# EAGLE design new_board (EAGLE 7.5.0)
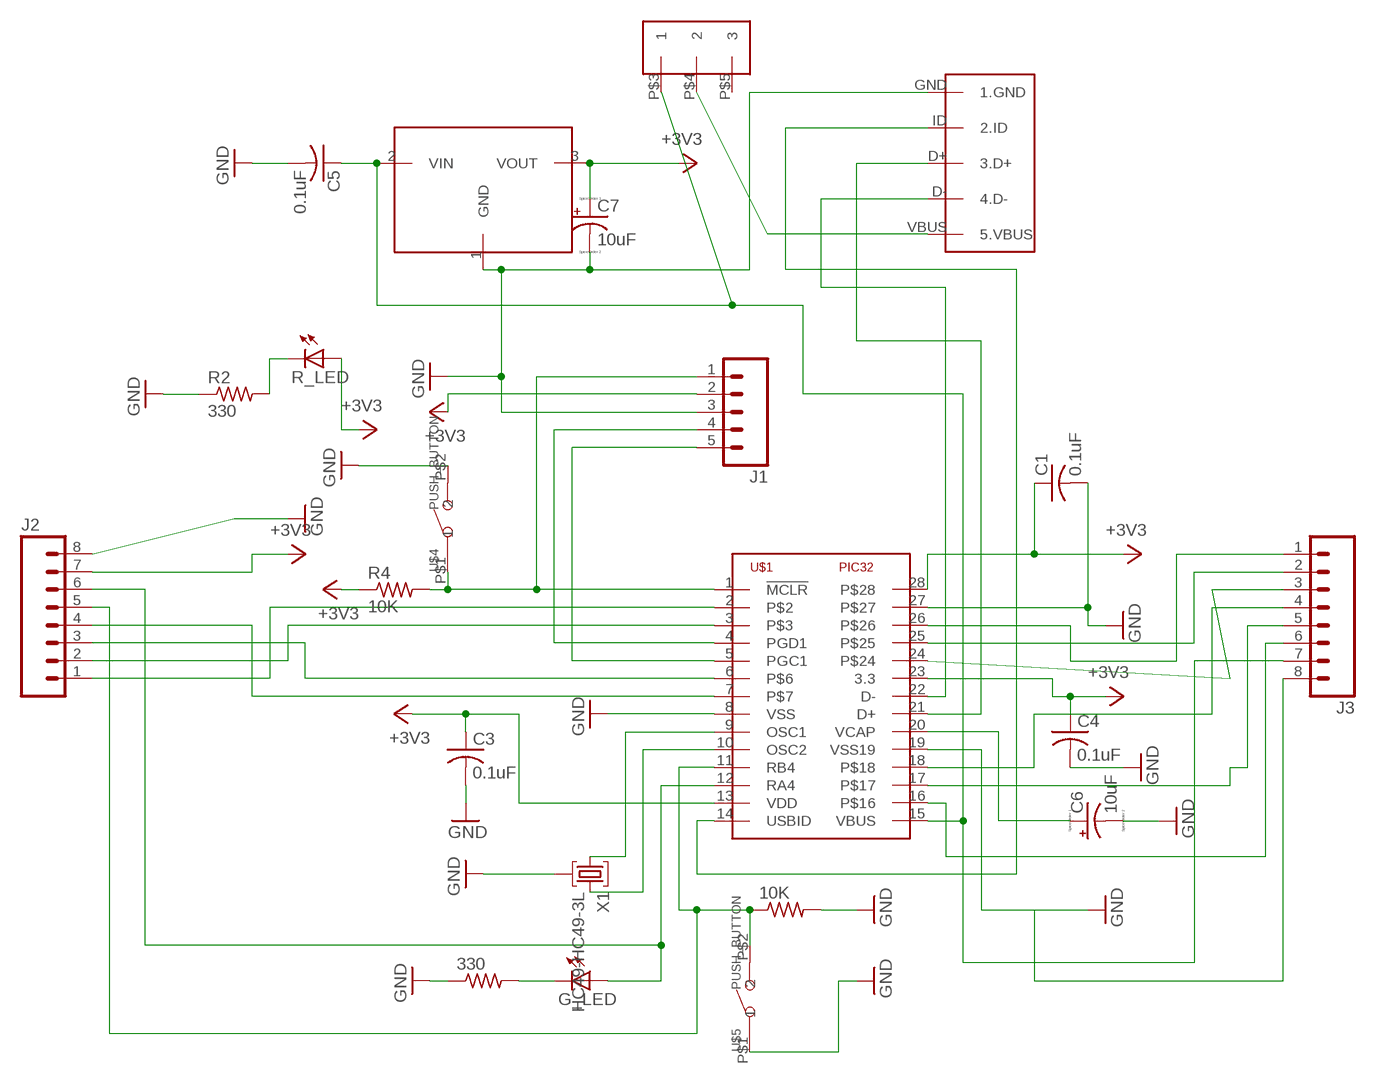
[diagram p0: schematic, sheet 1]

## Parts
10K  R-US_0207/10  [0207/10]
330  R-US_0207/10  [0207/10]
.  MINI_USB  [USB-MB-H]
C1  0.1uF  C-US025-025X050  [C025-025X050]
C3  0.1uF  C-US025-025X050  [C025-025X050]
C4  0.1uF  C-US025-025X050  [C025-025X050]
C5  0.1uF  C-US025-025X050  [C025-025X050]
C6  10uF  CPOL-USTT2D5  [TT2D5]
C7  10uF  CPOL-USTT2D5  [TT2D5]
G_LED  LED3MM  [LED3MM]
J1  M05NO_SILK  [1X05_NO_SILK]
J2  M08  [1X08_ROUND]
J3  M08  [1X08_ROUND]
R2  330  R-US_0207/10  [0207/10]
R4  10K  R-US_0207/10  [0207/10]
R_LED  LED3MM  [LED3MM]
U$1  PIC32  [DIL28-3]
U$3  SLIDE_SWITCH  [SLIDE_SWITCH]
U$4  PUSH_BUTTON  [PUSH_BUTTON]
U$5  PUSH_BUTTON  [PUSH_BUTTON]
U$9  MCP1702  [TO92]
X1  HC49-HC49-3L  [HC49-3L]

## Nets
+3V3: C1.1 C3.1 C4.1 C7.+ J1.2 J2.7 R4.1 R_LED.A U$1.13(VDD) U$1.23(3.3) U$1.28 U$9.3(VOUT)
GND: 10K.2 330.1 ..GND(1.GND) C1.2 C3.2 C4.2 C5.2 C6.- C7.- J1.3 J2.8 J3.8 R2.1 U$1.8(VSS) U$1.19(VSS19) U$1.27 U$4.P$2 U$5.P$1 U$9.1(GND) X1.2
N$1: ..ID(2.ID) U$1.14(USBID)
N$2: J1.4 U$1.4(PGD1)
N$3: J1.5 U$1.5(PGC1)
N$4: U$1.9(OSC1) X1.1
N$5: U$1.10(OSC2) X1.3
N$6: 10K.1 J2.5 U$1.11(RB4) U$5.P$2
N$8: R2.2 R_LED.K(C)
N$9: J1.1 R4.2 U$1.1(!MCLR) U$4.P$1
N$10: C6.+ U$1.20(VCAP)
N$11: 330.2 G_LED.K(C)
N$12: G_LED.A J2.6 U$1.12(RA4)
N$13: ..VBUS(5.VBUS) U$3.P$4
N$14: C5.1 J3.7 U$1.15(VBUS) U$3.P$3 U$9.2(VIN)
N$15: ..D-(4.D-) U$1.22(D-)
N$16: ..D+(3.D+) U$1.21(D+)
N$19: J2.1 U$1.2
N$20: J2.2 U$1.3
N$21: J2.3 U$1.6
N$22: J2.4 U$1.7
N$23: J3.1 U$1.26
N$24: J3.2 U$1.25
N$25: J3.3 U$1.24
N$26: J3.4 U$1.18
N$27: J3.5 U$1.17
N$28: J3.6 U$1.16
Unconnected: U$3.P$5

## Library data of the parts
10K 330 R2 R4 = new_library:R-US_: RESISTOR, American symbol
. = new_library:MINI_USB
C1 C3-C5 = new_library:C-US: CAPACITOR, American symbol
C6 C7 = new_library:CPOL-US: POLARIZED CAPACITOR, American symbol
G_LED R_LED = new_library:LED: LED OSRAM: - CHIPLED LG R971, LG N971, LY N971, LG Q971, LY Q971, LO R971, LY R971 LH N974, LH R974 LS Q976, LO Q976, LY Q976 LO Q996 - Hyper CHIPLED LW Q18S LB Q993, LB Q99A, LB R99A - SideLED LS A670, LO A670, LY A670, LG A670, LP A670 LB A673, LV A673, LT A673, LW A673 LH A674 LY A675 LS A676, LA A676, LO A676, LY A676, LW A676 LS A679, LY A679, LG A679 - Hyper Micro SIDELED® LS Y876, LA Y876, LO Y876, LY Y876 LT Y87S - SmartLED LW L88C, LW L88S LB L89C, LB L89S, LG L890 LS L89K, LO L89K, LY L89K LS L896, LA L896, LO L896, LY L896 - TOPLED LS T670, LO T670, LY T670, LG T670, LP T670 LSG T670, LSP T670, LSY T670, LOP T670, LYG T670 LG T671, LOG T671, LSG T671 LB T673, LV T673, LT T673, LW T673 LH T674 LS T676, LA T676, LO T676, LY T676, LB T676, LH T676, LSB T676, LW T676 LB T67C, LV T67C, LT T67C, LS T67K, LO T67K, LY T67K, LW E67C LS E67B, LA E67B, LO E67B, LY E67B, LB E67C, LV E67C, LT E67C LW T67C LS T679, LY T679, LG T679 LS T770, LO T770, LY T770, LG T770, LP T770 LB T773, LV T773, LT T773, LW T773 LH T774 LS E675, LA E675, LY E675, LS T675 LS T776, LA T776, LO T776, LY T776, LB T776 LHGB T686 LT T68C, LB T68C - Hyper Mini TOPLED® LB M676 - Mini TOPLED Santana® LG M470 LS M47K, LO M47K, LY M47K Source: http://www.osram.convergy.de LUXEON: - LUMILED® LXK2-PW12-R00, LXK2-PW12-S00, LXK2-PW14-U00, LXK2-PW14-V00 LXK2-PM12-R00, LXK2-PM12-S00, LXK2-PM14-U00 LXK2-PE12-Q00, LXK2-PE12-R00, LXK2-PE12-S00, LXK2-PE14-T00, LXK2-PE14-U00 LXK2-PB12-K00, LXK2-PB12-L00, LXK2-PB12-M00, LXK2-PB14-N00, LXK2-PB14-P00, LXK2-PB14-Q00 LXK2-PR12-L00, LXK2-PR12-M00, LXK2-PR14-Q00, LXK2-PR14-R00 LXK2-PD12-Q00, LXK2-PD12-R00, LXK2-PD12-S00 LXK2-PH12-R00, LXK2-PH12-S00 LXK2-PL12-P00, LXK2-PL12-Q00, LXK2-PL12-R00 Source: www.luxeon.com KINGBRIGHT: KA-3528ASYC Source: www.kingbright.com
J1 = new_library:M05: Header 5 Standard 5-pin 0.1" header. Use with straight break away headers (SKU : PRT-00116), right angle break away headers (PRT-00553), swiss pins (PRT-00743), machine pins (PRT-00117), and female headers (PRT-00115). Molex polarized connector foot print use with SKU : PRT-08230 with associated crimp pins and housings.
J2 J3 = new_library:M08: Header 8 Standard 8-pin 0.1" header. Use with straight break away headers (SKU : PRT-00116), right angle break away headers (PRT-00553), swiss pins (PRT-00743), machine pins (PRT-00117), and female headers (PRT-00115).; PROD_ID: CONN-08437
U$1 = new_library:PIC32
U$3 = new_library:SLIDE_SWITCH
U$4 U$5 = new_library:PUSH_BUTTON
U$9 = new_library:MCP1702
X1 = new_library:HC49: Crystals; MFD: IQD Frequency Products

## Board
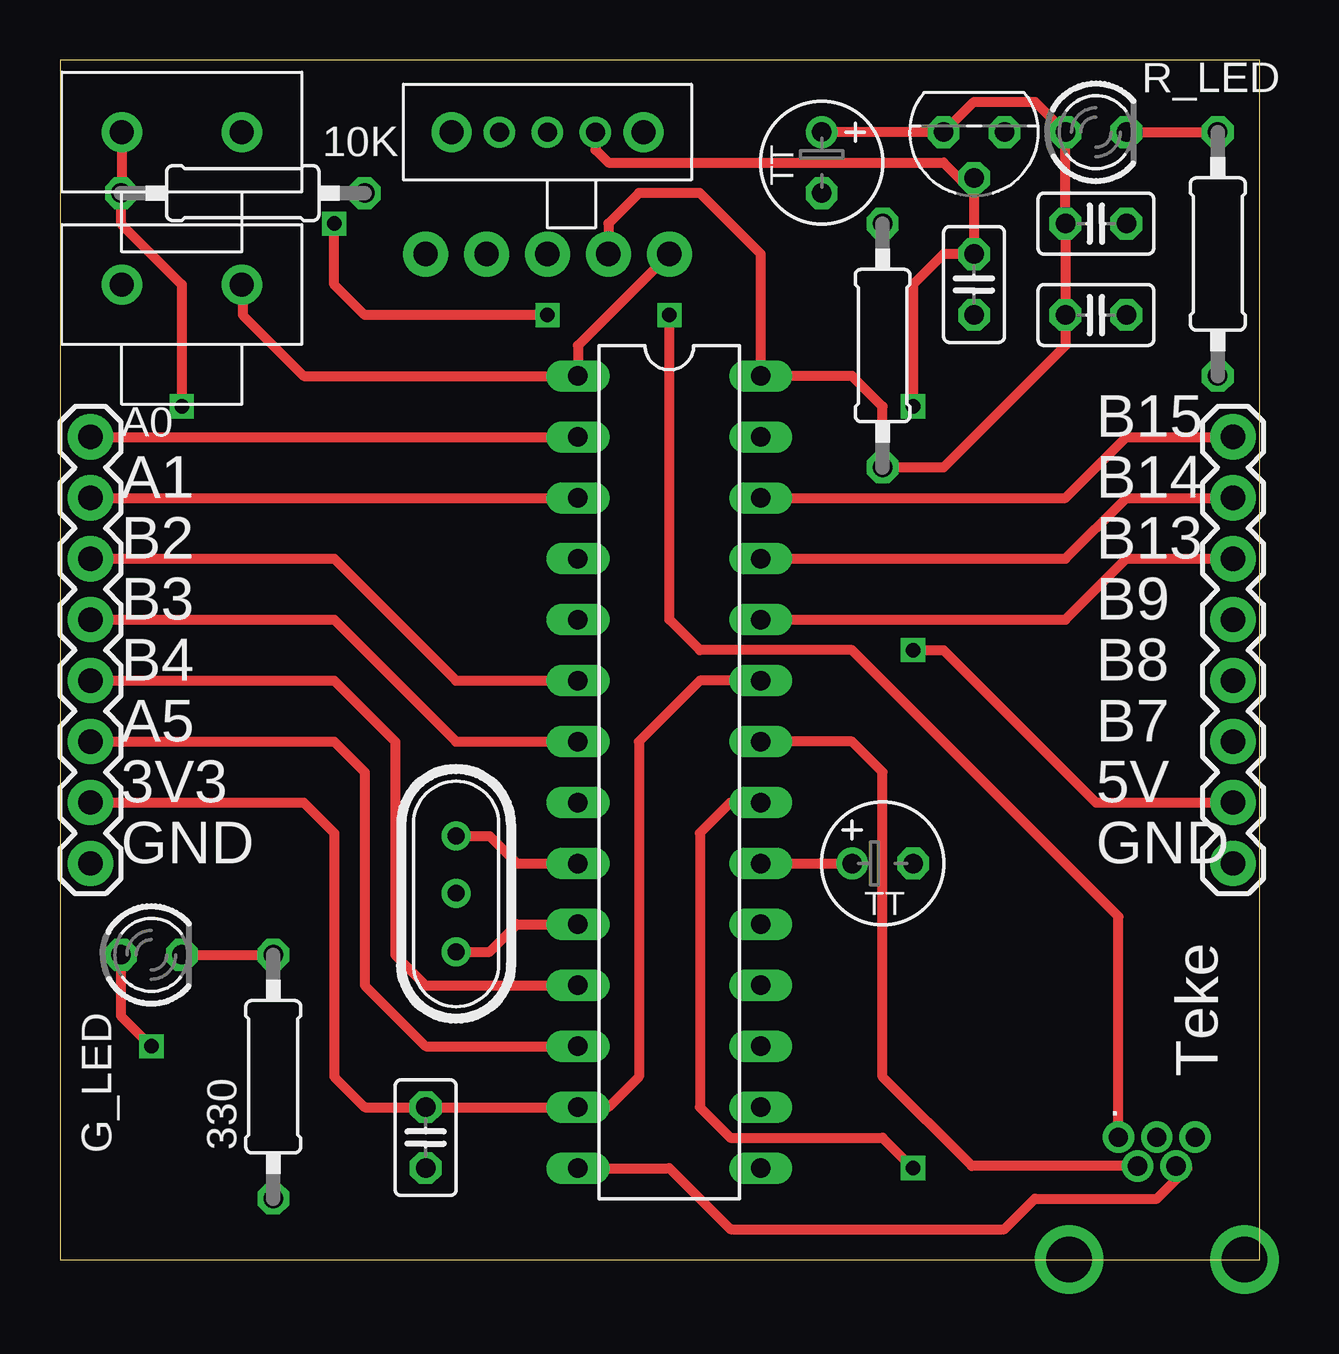
[diagram p1: board, top side]
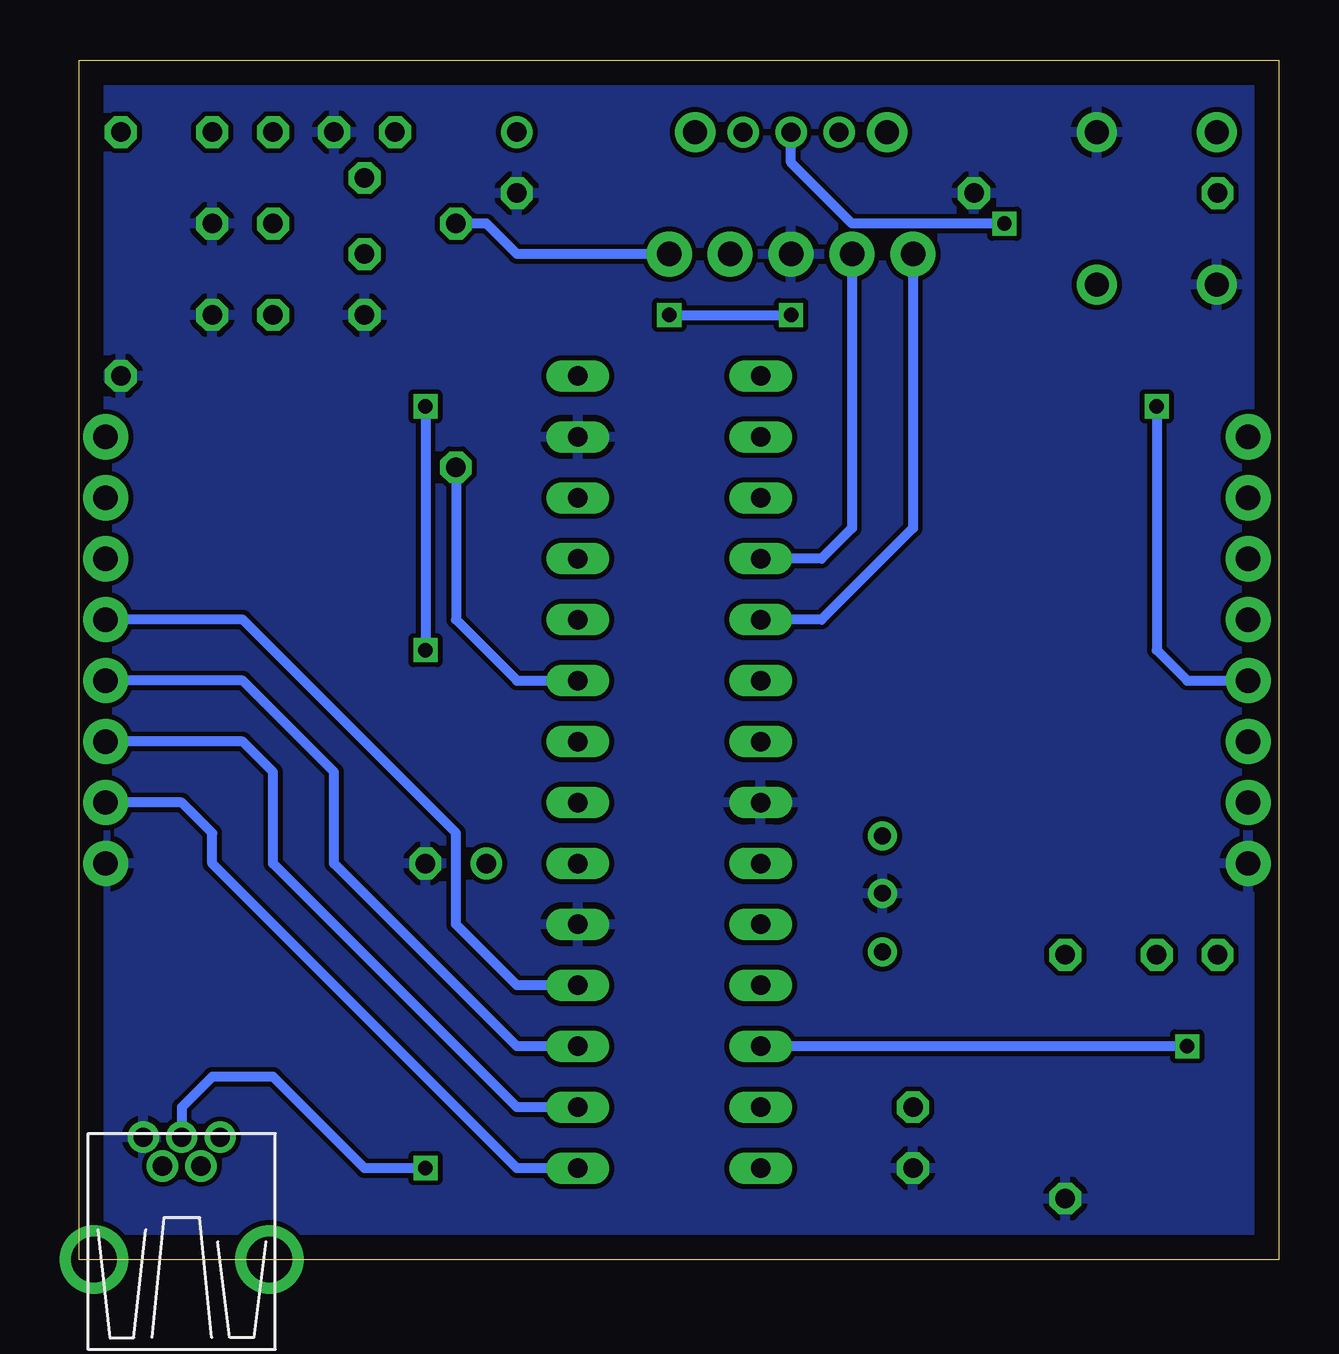
[diagram p2: board, bottom side, seen from below]

Size 50 x 50 mm. Coordinates in mm from the lower left corner, seen from the top.
Outline: 0,0 50,0 50,50 0,50 0,0
Copper layers (1*16): Top 0.035mm / dielectric 1.5mm / Bottom 0.035mm
Design rules "default": minimum track width 10mil, minimum drill 24mil, track to track 8mil, track to pad 8mil, pad to pad 8mil, via to via 8mil, smd to smd 8mil, copper to edge 40mil, drill to drill 8mil, minimum pad ring 10mil, minimum via ring 8mil, stop-mask expansion 4mil, vias tented up to drill 0mil, thermal gap 10mil

### Footprints (pad centres in the part's own frame; a part is rotated, then mirrored left to right if it is on the bottom)
0207/10 = drill 0.813 octagon: 1 -5.08,0; 2 5.08,0
USB-MB-H = drill 0.8: D+ 5.1,0; D- 3.9,0.8; GND 5.1,-1.6; ID 3.9,-0.8; VBUS 5.1,1.6 | drill 1.9: P$6 0,-3.65; P$7 0,3.65
C025-025X050 = drill 0.813 octagon: 1 -1.27,0; 2 1.27,0
TT2D5 = drill 0.813: + -1.27,0 | drill 0.813 octagon: - 1.27,0
LED3MM = drill 0.813 octagon: A -1.27,0; K 1.27,0
1X05_NO_SILK = drill 1.016 pad 1.88: 1 0,0; 2 2.54,0; 3 5.08,0; 4 7.62,0; 5 10.16,0
1X08_ROUND = drill 1.016 pad 1.88: 1 0,0; 2 2.54,0; 3 5.08,0; 4 7.62,0; 5 10.16,0; 6 12.7,0; 7 15.24,0; 8 17.78,0
DIL28-3 = drill 0.813 long: 1 -16.51,-3.81; 2 -13.97,-3.81; 3 -11.43,-3.81; 4 -8.89,-3.81; 5 -6.35,-3.81; 6 -3.81,-3.81; 7 -1.27,-3.81; 8 1.27,-3.81; 9 3.81,-3.81; 10 6.35,-3.81; 11 8.89,-3.81; 12 11.43,-3.81; 13 13.97,-3.81; 14 16.51,-3.81; 15 16.51,3.81; 16 13.97,3.81; 17 11.43,3.81; 18 8.89,3.81; 19 6.35,3.81; 20 3.81,3.81; 21 1.27,3.81; 22 -1.27,3.81; 23 -3.81,3.81; 24 -6.35,3.81; 25 -8.89,3.81; 26 -11.43,3.81; 27 -13.97,3.81; 28 -16.51,3.81
SLIDE_SWITCH = drill 1 pad 1.676: P$1 -4,0; P$2 4,0 | drill 0.8 pad 1.27: P$3 -2,0; P$4 0,0; P$5 2,0
PUSH_BUTTON = drill 1 pad 1.676: P$1 -2.5,0; P$2 2.5,0
TO92 = drill 0.813 octagon: 1 -1.27,0; 2 0,1.905; 3 1.27,0
HC49-3L = drill 0.7 pad 1.2: 1 -2.413,0; 2 -0.027,0; 3 2.413,0

### Placement (x,y rotation side)
10K  7.62,44.45 0 top
330  8.89,7.62 90 top
.  45.72,0 90 top
C1  43.18,43.18 0 top
C3  43.18,39.37 0 top
C4  15.24,5.08 270 top
C5  38.1,40.64 270 top
C6  34.29,16.51 0 top
C7  31.75,45.72 270 top
G_LED  3.81,12.7 0 top
J1  25.4,41.91 180 top
J2  1.27,34.29 270 top
J3  48.9,34.29 270 top
R2  48.26,41.91 90 top
R4  34.29,38.1 90 top
R_LED  43.18,46.99 0 top
U$1  25.4,20.32 270 top
U$3  20.32,46.99 180 top
U$4  5.08,40.64 180 top
U$5  5.08,46.99 180 top
U$9  38.1,46.99 180 top
X1  16.51,15.24 270 top

### Tracks (layer width: path | path; a pad name or v marks a point on that pad's centre or on a via)
+3V3
  Top 0.406: J2.7 10.16,19.05 11.43,17.78 11.43,7.62 12.7,6.35 C4.1 U$1.13 22.86,6.35 24.13,7.62 24.13,21.59 26.67,24.13 U$1.23 | C7.+ U$9.3 38.1,48.26 40.64,48.26 R_LED.A C1.1 C3.1 41.91,38.1 36.83,33.02 R4.1 34.29,35.56 33.02,36.83 U$1.28 29.21,41.91 26.67,44.45 24.13,44.45 22.86,43.18 J1.2
  Bottom 0.406: R4.1 34.29,26.67 31.75,24.13 U$1.23
GND
  pour Bottom: -1.27,50.8 -1.27,-2.54 52.07,-2.54 52.07,-1.27 52.07,50.8
N$1
  Top 0.406: U$1.14 25.4,3.81 27.94,1.27 39.37,1.27 40.64,2.54 45.72,2.54 46.99,3.81 46.61,3.81 ..ID
N$2
  Bottom 0.406: J1.4 17.78,30.48 19.05,29.21 U$1.4
N$3
  Bottom 0.406: J1.5 15.24,30.48 19.05,26.67 U$1.5
N$4
  Top 0.406: X1.1 17.91,17.65 19.05,16.51 U$1.9
N$5
  Top 0.406: X1.3 17.91,12.83 19.05,13.97 U$1.10
N$6  (via drill 0.6)
  Top 0.406: J2.5 11.43,24.13 13.97,21.59 13.97,12.7 15.24,11.43 U$1.11 | U$5.P$2 2.58,44.49 10K.1 2.54,43.18 5.08,40.64 v5.08,35.56
  Bottom 0.406: v5.08,35.56 5.08,25.4 3.81,24.13 J2.5
N$8
  Top 0.406: R_LED.K R2.2
N$9
  Top 0.406: U$4.P$1 7.62,40.64 7.62,39.37 10.16,36.83 U$1.1 21.59,38.1 J1.1
  Bottom 0.406: J1.1 31.75,41.91 33.02,43.18 R4.2
N$10
  Top 0.406: U$1.20 C6.+
N$11
  Top 0.406: G_LED.K 330.2
N$12  (via drill 0.6)
  Top 0.406: G_LED.A 2.54,10.16 v3.81,8.89 | J2.6 11.43,21.59 12.7,20.32 12.7,11.43 15.24,8.89 U$1.12
  Bottom 0.406: v3.81,8.89 U$1.12
N$13  (via drill 0.6)
  Top 0.406: ..VBUS 44.12,14.3 33.02,25.4 26.67,25.4 25.4,26.67 v25.4,39.37 | v20.32,39.37 12.7,39.37 11.43,40.64 v11.43,43.18
  Bottom 0.406: v25.4,39.37 v20.32,39.37 | v11.43,43.18 17.78,43.18 20.32,45.72 U$3.P$4
N$14  (via drill 0.6)
  Top 0.406: U$9.2 38.1,44.45 | 38.1,44.45 C5.1 36.83,41.91 35.56,40.64 v35.56,35.56 | U$3.P$3 22.32,46.26 22.86,45.72 36.83,45.72 38.1,44.45 | v35.56,25.4 36.83,25.4 43.18,19.05 J3.7
  Bottom 0.406: U$1.15 31.75,3.81 44.45,16.51 44.45,17.78 45.72,19.05 J3.7 | v35.56,35.56 v35.56,25.4
N$15
  Top 0.406: ..D- 38.01,3.9 34.29,7.62 34.29,20.32 33.02,21.59 U$1.22
N$16  (via drill 0.6)
  Top 0.406: ..D+ 45.72,5.08 | U$1.21 27.94,19.05 26.67,17.78 26.67,6.35 27.94,5.08 34.29,5.08 v35.56,3.81
  Bottom 0.406: v35.56,3.81 38.1,3.81 41.91,7.62 44.45,7.62 45.72,6.35 ..D+
N$19
  Top 0.406: J2.1 U$1.2
N$20
  Top 0.406: J2.2 U$1.3
N$21
  Top 0.406: J2.3 11.43,29.21 16.51,24.13 U$1.6
N$22
  Top 0.406: J2.4 11.43,26.67 16.51,21.59 U$1.7
N$23
  Top 0.406: U$1.26 41.91,31.75 44.45,34.29 J3.1
N$24
  Top 0.406: U$1.25 41.91,29.21 44.45,31.75 J3.2
N$25
  Top 0.406: U$1.24 41.91,26.67 44.45,29.21 J3.3
N$26
  Bottom 0.406: U$1.18 31.75,11.43 34.29,13.97 34.29,17.78 43.18,26.67 J3.4
N$27
  Bottom 0.406: U$1.17 31.75,8.89 39.37,16.51 39.37,20.32 43.18,24.13 J3.5
N$28
  Bottom 0.406: U$1.16 31.75,6.35 41.91,16.51 41.91,20.32 43.18,21.59 J3.6

### Text on the board
tPlace: A0 | B15 | A1 | B14 | B2 | B13 | B3 | B9 | B4 | B8 | A5 | B7 | 3V3 | 5V | GND | GND | Teke